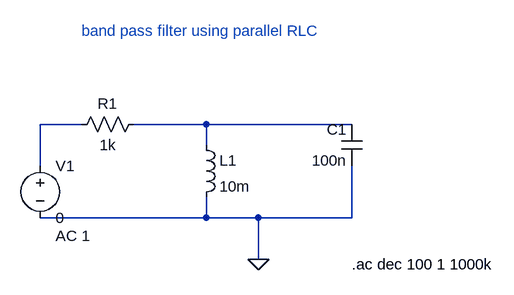
[diagram p0: schematic band_pass_filter2.asc]
band_pass_filter2.asc, the LTspice schematic file:
Version 4
SHEET 1 880 680
WIRE -48 48 -112 48
WIRE 144 48 32 48
WIRE 368 48 144 48
WIRE 144 80 144 48
WIRE -112 112 -112 48
WIRE 144 192 144 160
WIRE 144 192 -112 192
WIRE 224 192 144 192
WIRE 368 192 368 112
WIRE 368 192 224 192
WIRE 224 256 224 192
FLAG 224 256 0
SYMBOL res 48 32 R90
WINDOW 0 0 56 VBottom 2
WINDOW 3 32 56 VTop 2
SYMATTR InstName R1
SYMATTR Value 1k
SYMBOL cap 384 112 R180
WINDOW 0 24 56 Left 2
WINDOW 3 24 8 Left 2
SYMATTR InstName C1
SYMATTR Value 100n
SYMBOL ind 128 64 R0
SYMATTR InstName L1
SYMATTR Value 10m
SYMBOL voltage -112 96 R0
WINDOW 123 24 124 Left 2
WINDOW 39 0 0 Left 0
SYMATTR InstName V1
SYMATTR Value 0
SYMATTR Value2 AC 1
TEXT 368 264 Left 2 !.ac dec 100 1 1000k
TEXT 136 -96 Center 2 ;band pass filter using parallel RLC

The netlist it stands for:
* band_pass_filter2.asc
R1 N002 N001 1k
C1 0 N002 100n
L1 N002 0 10m
V1 N001 0 0 AC 1
.ac dec 100 1 1000k
* band pass filter using parallel RLC
.backanno
.end